# Altium project load_cell_amp.PrjPCB
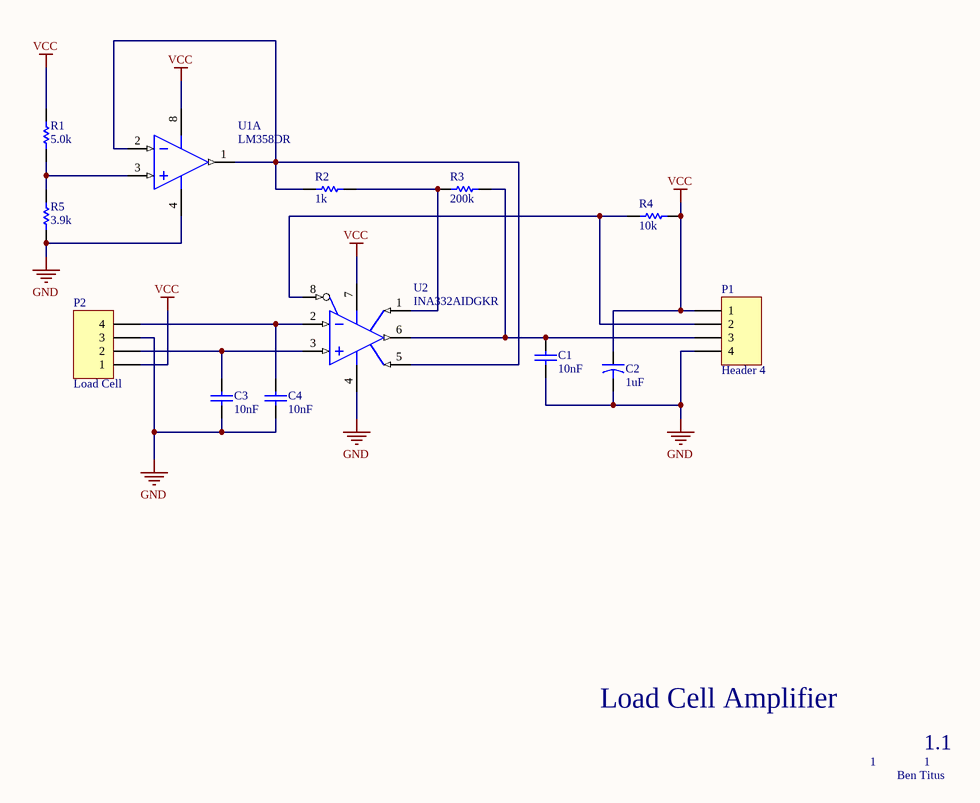
[diagram p0: load_cell_amp.SchDoc]
1 sheet, 13 parts. Net scope: global (net labels, ports and power ports of the same name join across sheets).
Board file: load_cell_amp.PcbDoc

## Sheet load_cell_amp.SchDoc
size A

### Parts
C1  10nF  [CAPC0805(2012)145_L]
C2  1uF  [CAPR5-4X5]
C3  10nF  [CAPC0805(2012)145_L]
C4  10nF  [CAPC0805(2012)145_L]
P1  Header 4  [HDR1X4]
P2  Load Cell  [HDR1X4]
R1  5.0k  [RESC0805(2012)_L]
R2  1k  [RESC0805(2012)_L]
R3  200k  [RESC0805(2012)_L]
R4  10k  [RESC0805(2012)_L]
R5  3.9k  [RESC0805(2012)_L]
U1  LM358DR  [D0008A_L]  (part A of 2)
U2  INA332AIDGKR  [DGK0008A_M]

### Nets
GND: C1.1 C2.2 C3.1 C4.1 P1.4 P2.3 R5.1 U1.4(GND) U2.4(V-)
VCC: C2.1 P1.1 P2.1 R1.2 R4.1 U1.8(VCC) U2.7(V+)
NetC1_2: C1.2 P1.3 R3.2 U2.6(VOUT)
NetC3_2: C3.2 P2.2 U2.3(VIN+)
NetC4_2: C4.2 P2.4 U2.2(VIN-)
NetP1_2: P1.2 R4.2 U2.8(SHUTDOWN)
NetR1_1: R1.1 R5.2 U1.3(1IN+)
NetR2_1: R2.1 U1.1(1OUT) U1.2(1IN-) U2.5(REF)
NetR2_2: R2.2 R3.1 U2.1(RG)

### Notes on the sheet
- Load Cell Amplifier
- 1
- 1.1
- Ben Titus

### Library data of the parts
C1 C3 C4 = CMP-1590-00003-1: 0805 (2012 Metric) Chip Capacitor; Case-EIA: 0805; Case-Metric: 2012; PackageReference: CAPC0805(2012)145
C2 = Cap2: Capacitor; Published: 23-Sep-2002; PackageReference: CAPR5-4X5; Publisher: Altium Limited; PackageDescription: Capacitor; 2 Leads; Value: 1uF
P1 P2 = Header 4: Header, 4-Pin; LatestRevisionDate: 17-Jul-2002; LatestRevisionNote: Re-released for DXP Platform.; Publisher: Altium Limited
R1-R5 = CMP-1591-00002-1: 0805 (2012 Metric) Chip Resistor; Case-EIA: 0805; Case-Metric: 2012; PackageReference: RESC0805(2012)
U1 = CMP-1685-00009-1: Dual Operational Amplifier, 3 to 32 V, 0 to 70 degC, 8-Pin SOIC (D), Green (RoHS & no Sb/Br), Tape and Reel; DatasheetVersion: SLOS068T, 04/2015; ComponentLink1URL: http://www.ti.com/; ComponentLink2URL: http://www.ti.com/lit/ds/symlink/lm358.pdf; ComponentLink3Description: Package Specification; Code_JEDEC: MS-012; PackageDescription: 8-Pin Small Outline Integrated Circuit, Body 4.9 x 3.9 mm, Pitch 1.27 mm; ComponentLink2Description: Datasheet; PackageVersion: 4040047-3/M, 06/2011; ComponentLink1Description: Manufacturer URL; ComponentLink3URL: http://www.ti.com/lit/ml/msoi002j/msoi002j.pdf; PackageReference: D0008A
U2 = CMP-0944-00077-2: Low-Power, Single Supply, CMOS, Low Cost, Instrumentation Amplifier, -55 to 125 degC, 8-pin SOP (DGK8), Green (RoHS & no Sb/Br); Manufacturer: Texas Instruments; Noise at 1kHz(Typ)(nV/rt(Hz)): 46; Quiescent Current (+/-)(Typ)(mA): 0.415; Gain(V/V): 5 to 1000; Vs(Min)(V): 2.5; Number of Channels: 1; Vs(Max)(V): 5.5; CMRR(Min)(dB): 60; Input Bias Current (+/-)(Max)(nA): 0.01; Input Offset (+/-)(Max)(uV): 8000; DatasheetVersion: SBOS216B; ComponentLink3URL: http://www.ti.com/litv/pdf/mpds028d; PartNumber: INA332AIDGKR; ComponentLink2Description: Datasheet; ComponentLink1URL: http://www.ti.com/; ComponentLink1Description: Manufacturer URL; Code_JEDEC: MO-187; SubFamily: Single Supply; ComponentLink3Description: Package Specification; Mounting Technology: Surface Mount; PackageReference: DGK0008A; PackageDescription: 8-Pin Thin Small Outline, Body 3 x 3 mm, Pitch 0.65 mm; PackageVersion: 4073329/E, 05/2006; Eco-Plan: Green (RoHS & no Sb/Br); Non-Linearity (+/-)(Max)(%): 0.01; ComponentLink2URL: http://www.ti.com/general/docs/lit/getliterature.tsp?genericPartNumber=INA332&fileType=pdf